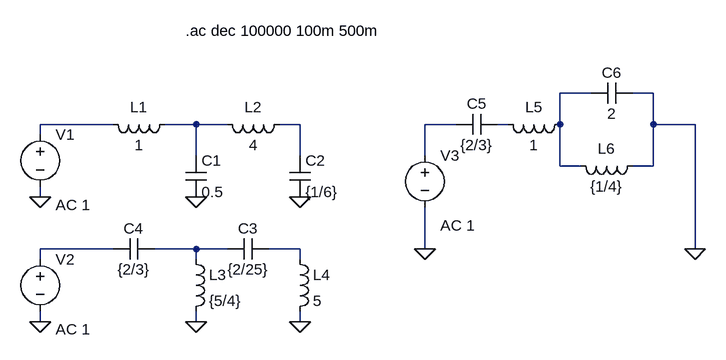
[diagram p0: schematic 1_e.asc]
1_e.asc, the LTspice schematic file:
Version 4.1
SHEET 1 996 680
WIRE 816 48 768 48
WIRE 912 48 880 48
WIRE 80 96 -32 96
WIRE 208 96 160 96
WIRE 256 96 208 96
WIRE 368 96 336 96
WIRE 608 96 560 96
WIRE 688 96 672 96
WIRE 768 96 768 48
WIRE 912 96 912 48
WIRE 976 96 912 96
WIRE -32 112 -32 96
WIRE 208 144 208 96
WIRE 368 144 368 96
WIRE 560 144 560 96
WIRE 768 160 768 96
WIRE 800 160 768 160
WIRE 912 160 912 96
WIRE 912 160 880 160
WIRE -32 208 -32 192
WIRE 80 288 -32 288
WIRE 208 288 144 288
WIRE 256 288 208 288
WIRE 368 288 320 288
WIRE 560 288 560 224
WIRE 976 288 976 96
WIRE -32 304 -32 288
WIRE 208 304 208 288
WIRE 368 304 368 288
WIRE -32 400 -32 384
WIRE 208 400 208 384
WIRE 368 400 368 384
FLAG 368 208 0
FLAG 208 208 0
FLAG -32 208 0
FLAG 368 400 0
FLAG 208 400 0
FLAG -32 400 0
FLAG 976 288 0
FLAG 560 288 0
SYMBOL ind 176 80 R90
WINDOW 0 5 56 VBottom 2
WINDOW 3 32 56 VTop 2
SYMATTR InstName L1
SYMATTR Value 1
SYMBOL ind 352 80 R90
WINDOW 0 5 56 VBottom 2
WINDOW 3 32 56 VTop 2
SYMATTR InstName L2
SYMATTR Value 4
SYMBOL cap 192 144 R0
SYMATTR InstName C1
SYMATTR Value 0.5
SYMBOL cap 352 144 R0
SYMATTR InstName C2
SYMATTR Value {1/6}
SYMBOL voltage -32 96 R0
WINDOW 123 24 124 Left 2
WINDOW 39 0 0 Left 0
SYMATTR InstName V1
SYMATTR Value ""
SYMATTR Value2 AC 1
SYMBOL voltage -32 288 R0
WINDOW 123 24 124 Left 2
WINDOW 39 0 0 Left 0
SYMATTR InstName V2
SYMATTR Value ""
SYMATTR Value2 AC 1
SYMBOL ind 192 288 R0
SYMATTR InstName L3
SYMATTR Value {5/4}
SYMBOL ind 352 288 R0
SYMATTR InstName L4
SYMATTR Value 5
SYMBOL cap 320 272 R90
WINDOW 0 0 32 VBottom 2
WINDOW 3 32 32 VTop 2
SYMATTR InstName C3
SYMATTR Value {2/25}
SYMBOL cap 144 272 R90
WINDOW 0 0 32 VBottom 2
WINDOW 3 32 32 VTop 2
SYMATTR InstName C4
SYMATTR Value {2/3}
SYMBOL ind 784 80 R90
WINDOW 0 5 56 VBottom 2
WINDOW 3 32 56 VTop 2
SYMATTR InstName L5
SYMATTR Value 1
SYMBOL cap 672 80 R90
WINDOW 0 0 32 VBottom 2
WINDOW 3 32 32 VTop 2
SYMATTR InstName C5
SYMATTR Value {2/3}
SYMBOL cap 880 32 R90
WINDOW 0 0 32 VBottom 2
WINDOW 3 32 32 VTop 2
SYMATTR InstName C6
SYMATTR Value 2
SYMBOL ind 896 144 R90
WINDOW 0 5 56 VBottom 2
WINDOW 3 32 56 VTop 2
SYMATTR InstName L6
SYMATTR Value {1/4}
SYMBOL voltage 560 128 R0
WINDOW 123 24 124 Left 2
WINDOW 39 0 0 Left 0
SYMATTR InstName V3
SYMATTR Value ""
SYMATTR Value2 AC 1
TEXT 192 -48 Left 2 !.ac dec 100000 100m 500m

The netlist it stands for:
* 1_e.asc
L1 N003 N002 1
L2 N004 N003 4
C1 N003 0 0.5
C2 N004 0 {1/6}
V1 N002 0 AC 1
V2 N007 0 AC 1
L3 N008 0 {5/4}
L4 N009 0 5
C3 N009 N008 {2/25}
C4 N008 N007 {2/3}
L5 N001 N006 1
C5 N006 N005 {2/3}
C6 0 N001 2
L6 0 N001 {1/4}
V3 N005 0 AC 1
.ac dec 100000 100m 500m
.backanno
.end